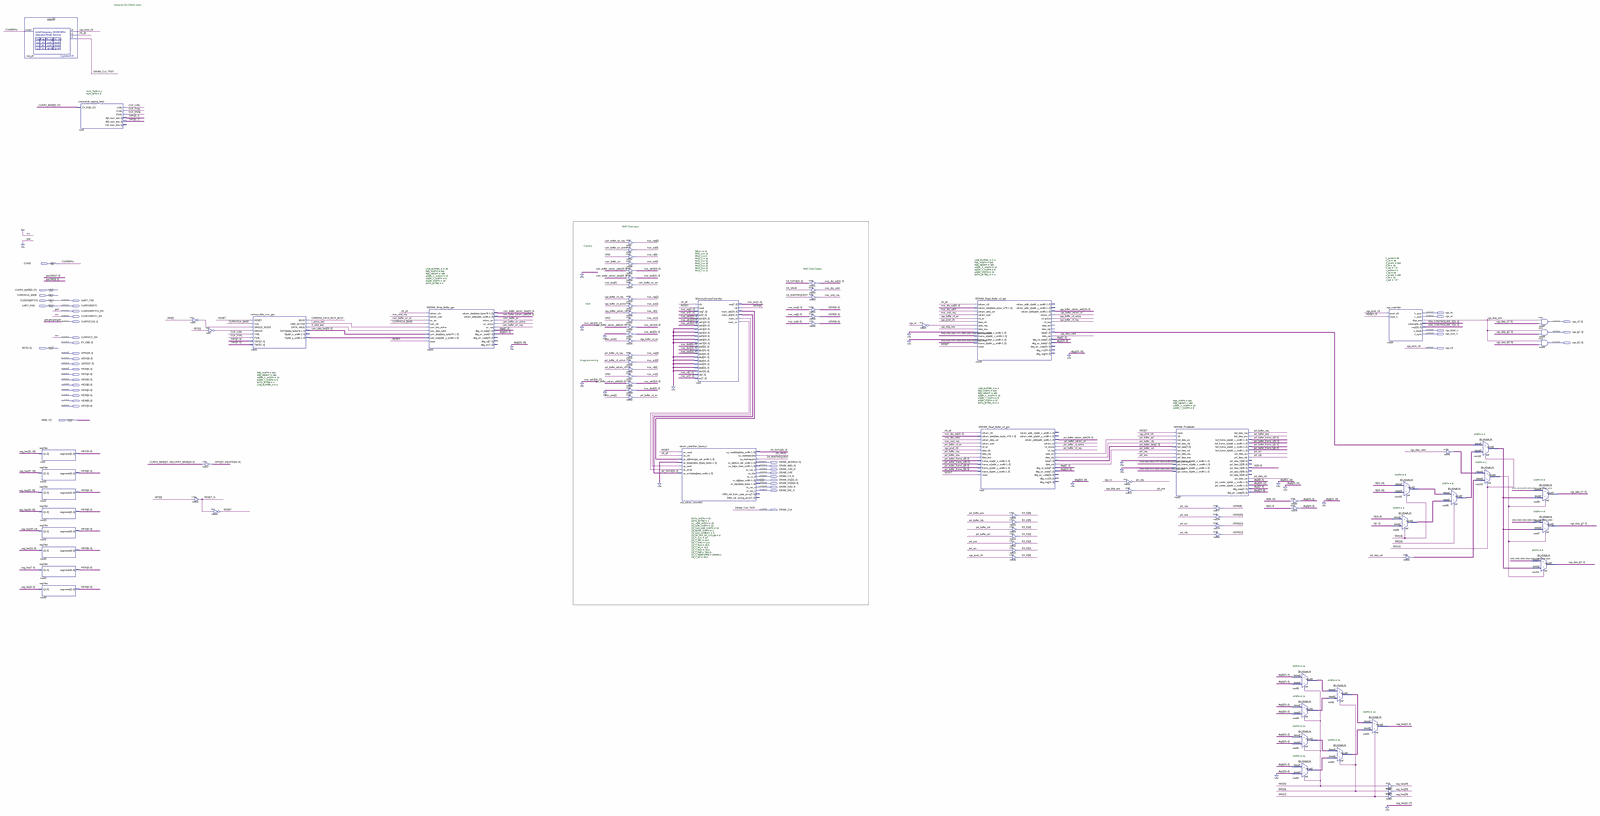
[diagram p0: schematic sheet, whole]
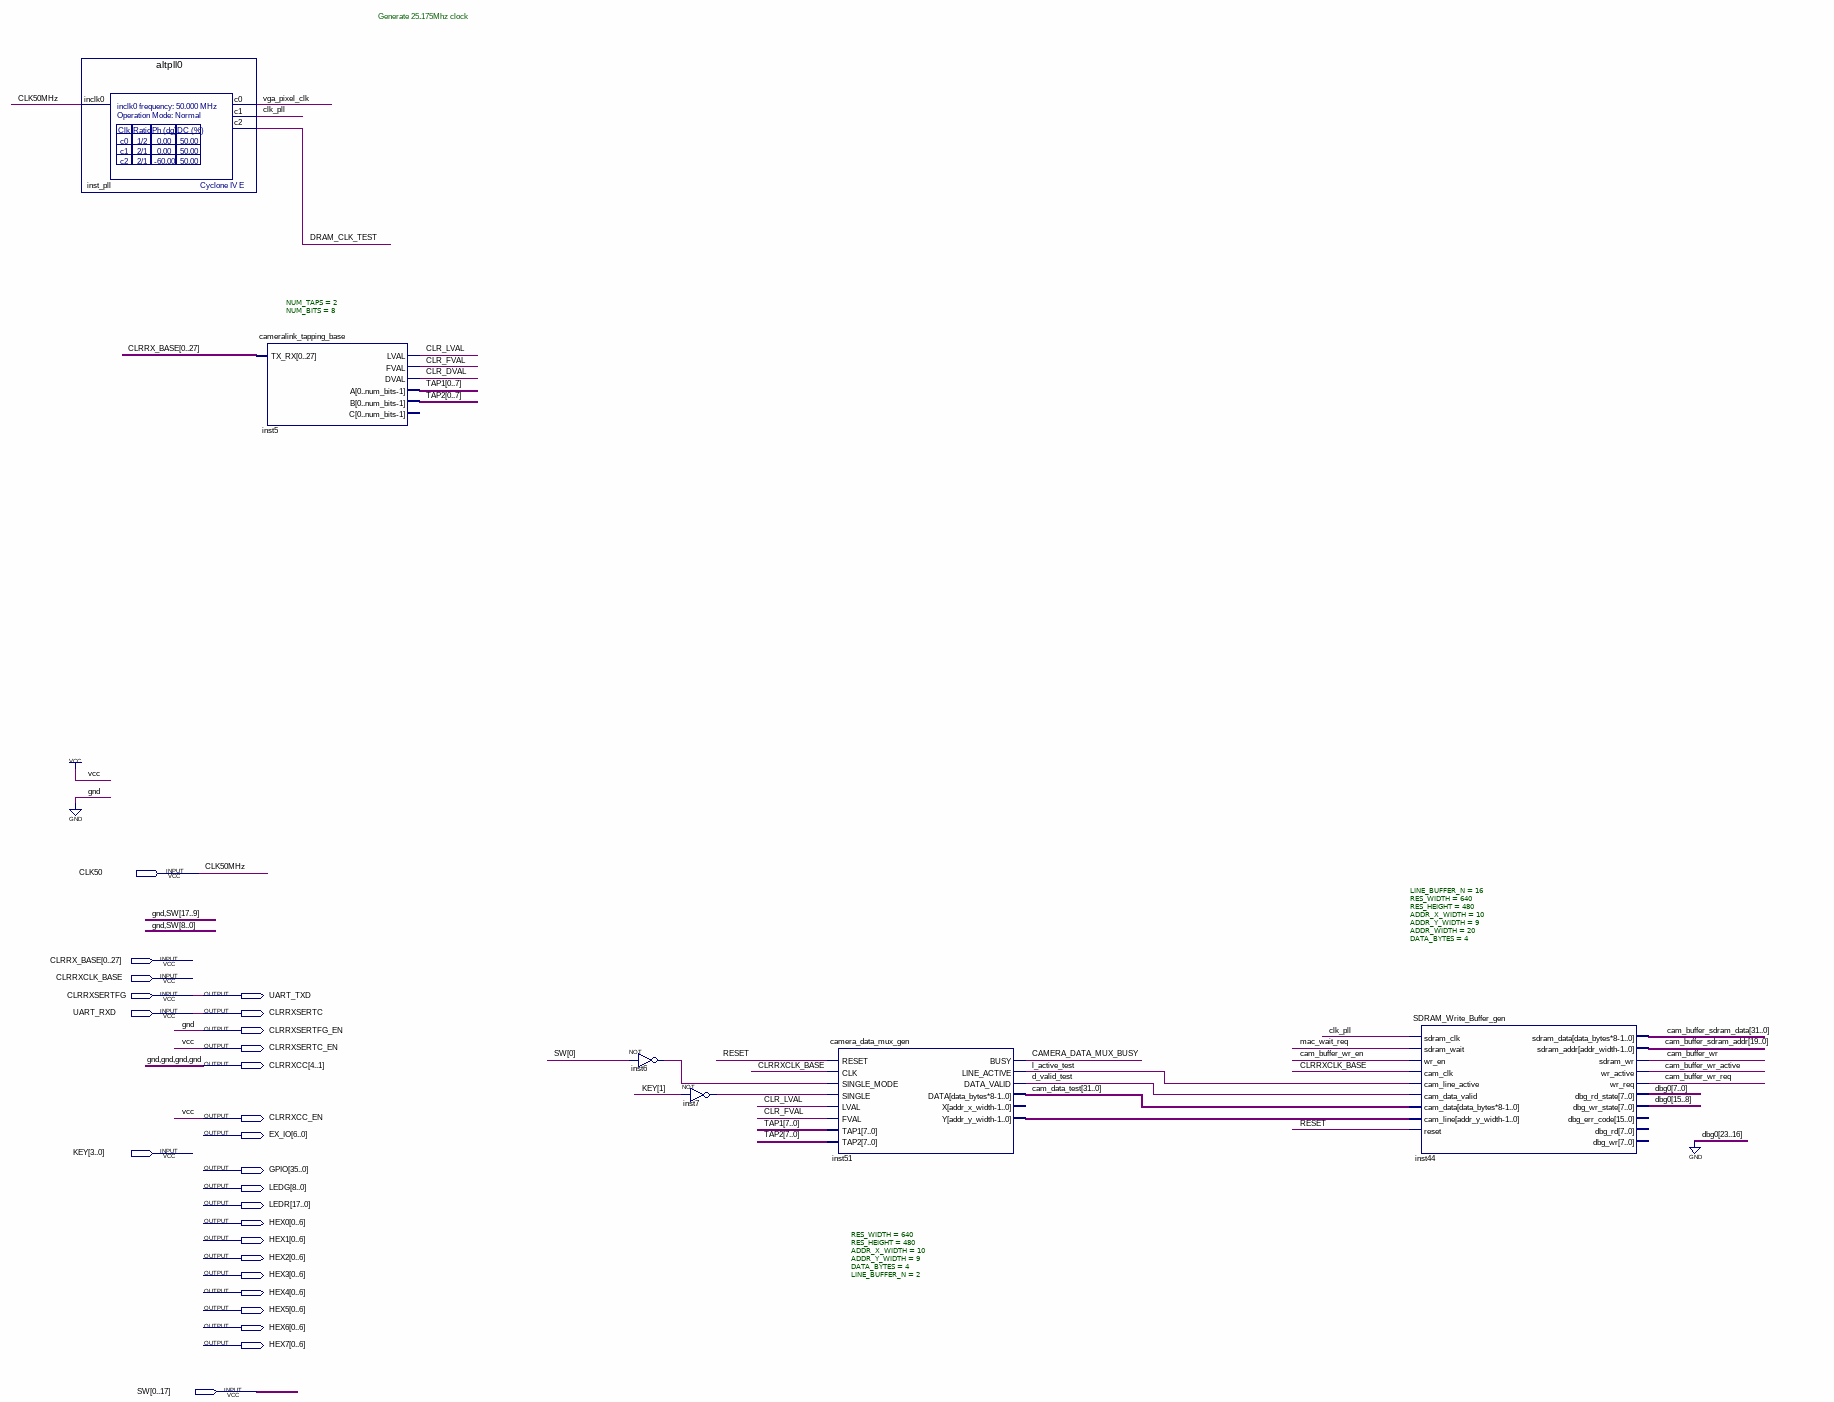
[diagram p1: schematic sheet, upper left part]
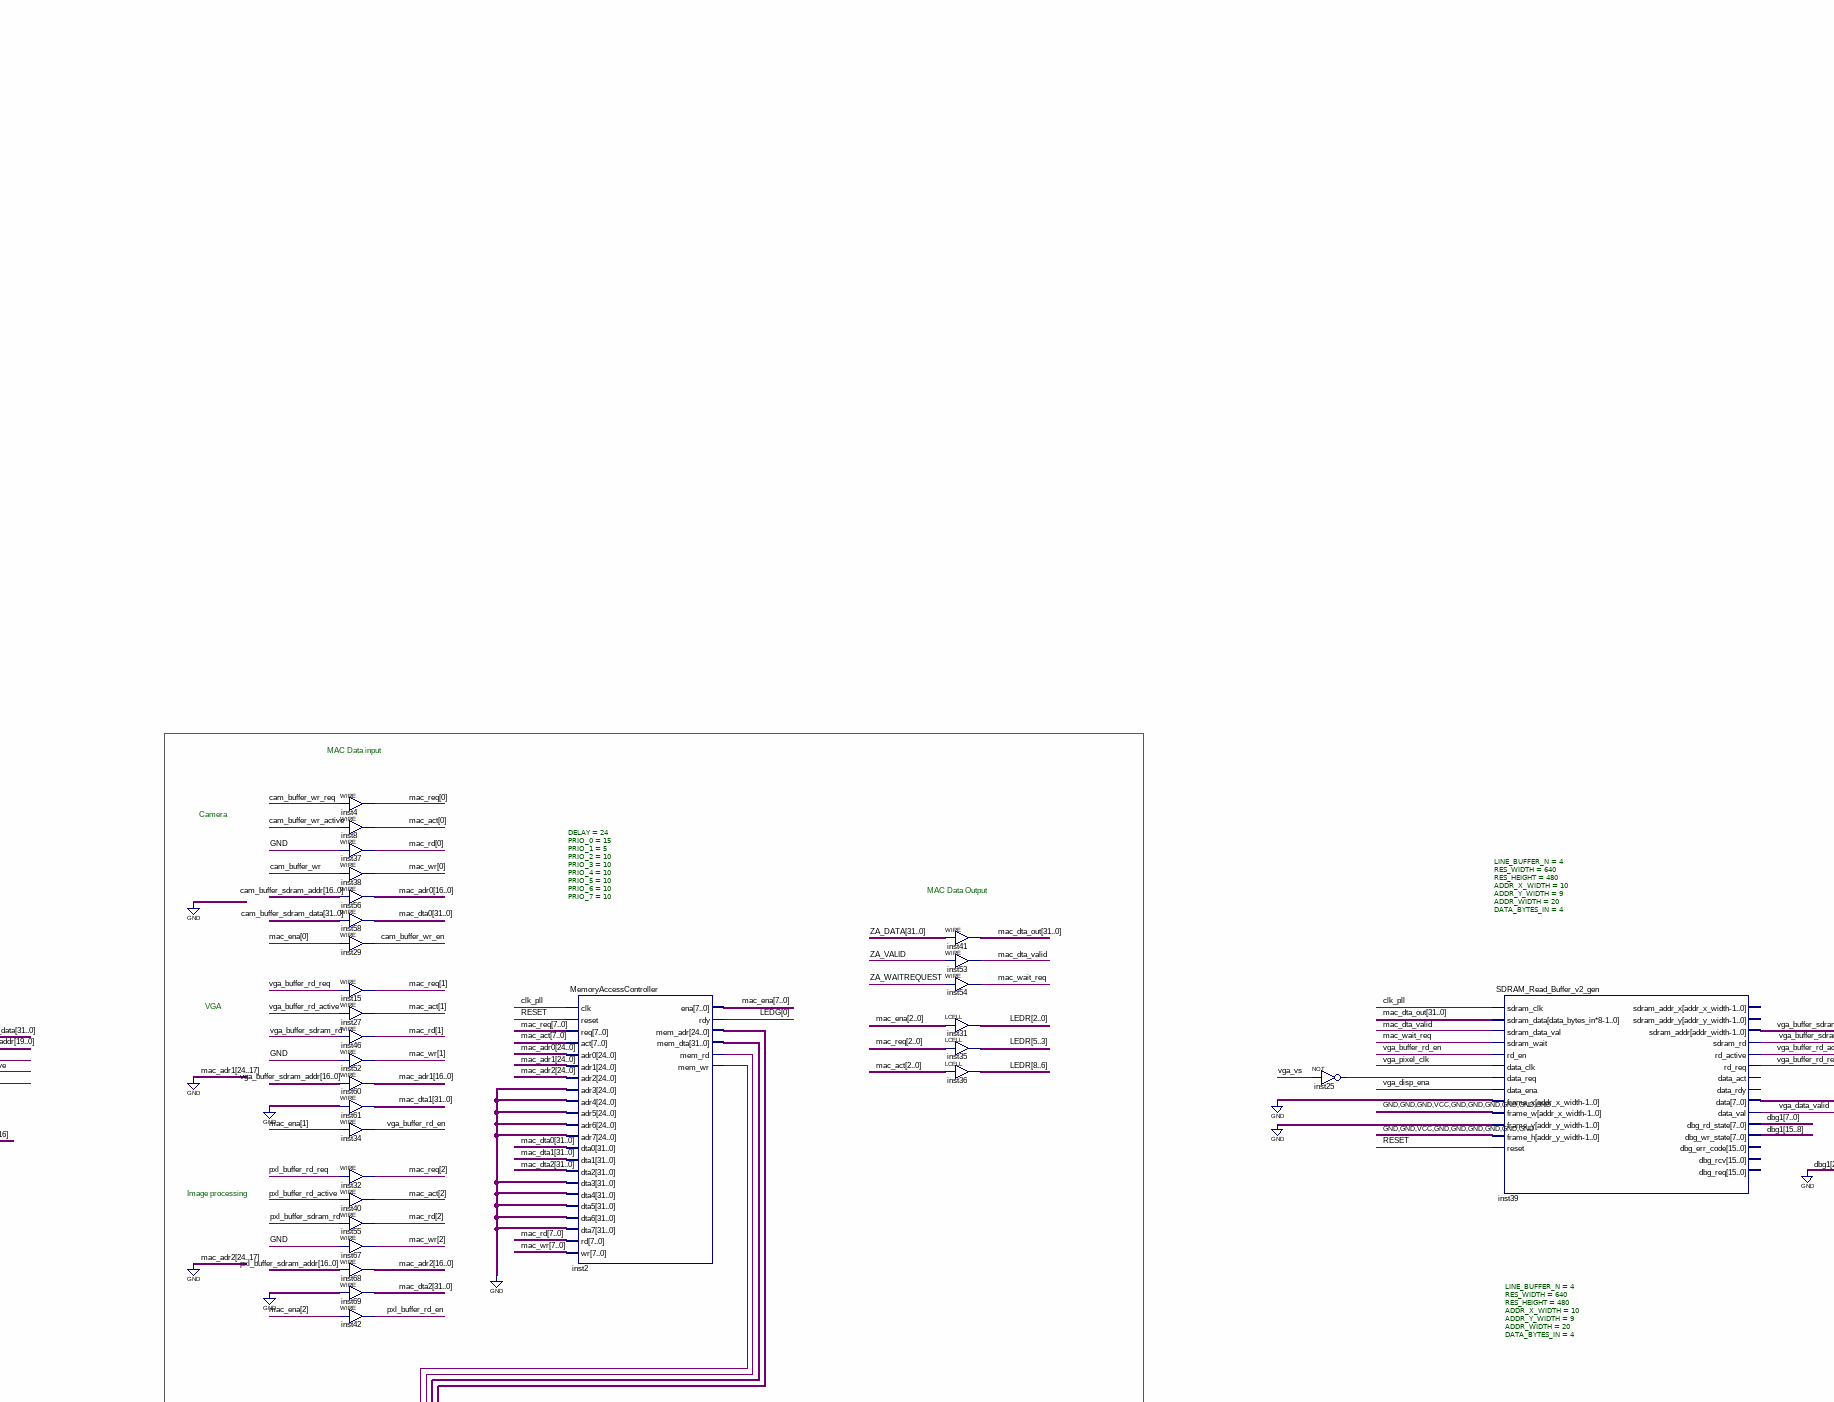
[diagram p2: schematic sheet, upper centre part]
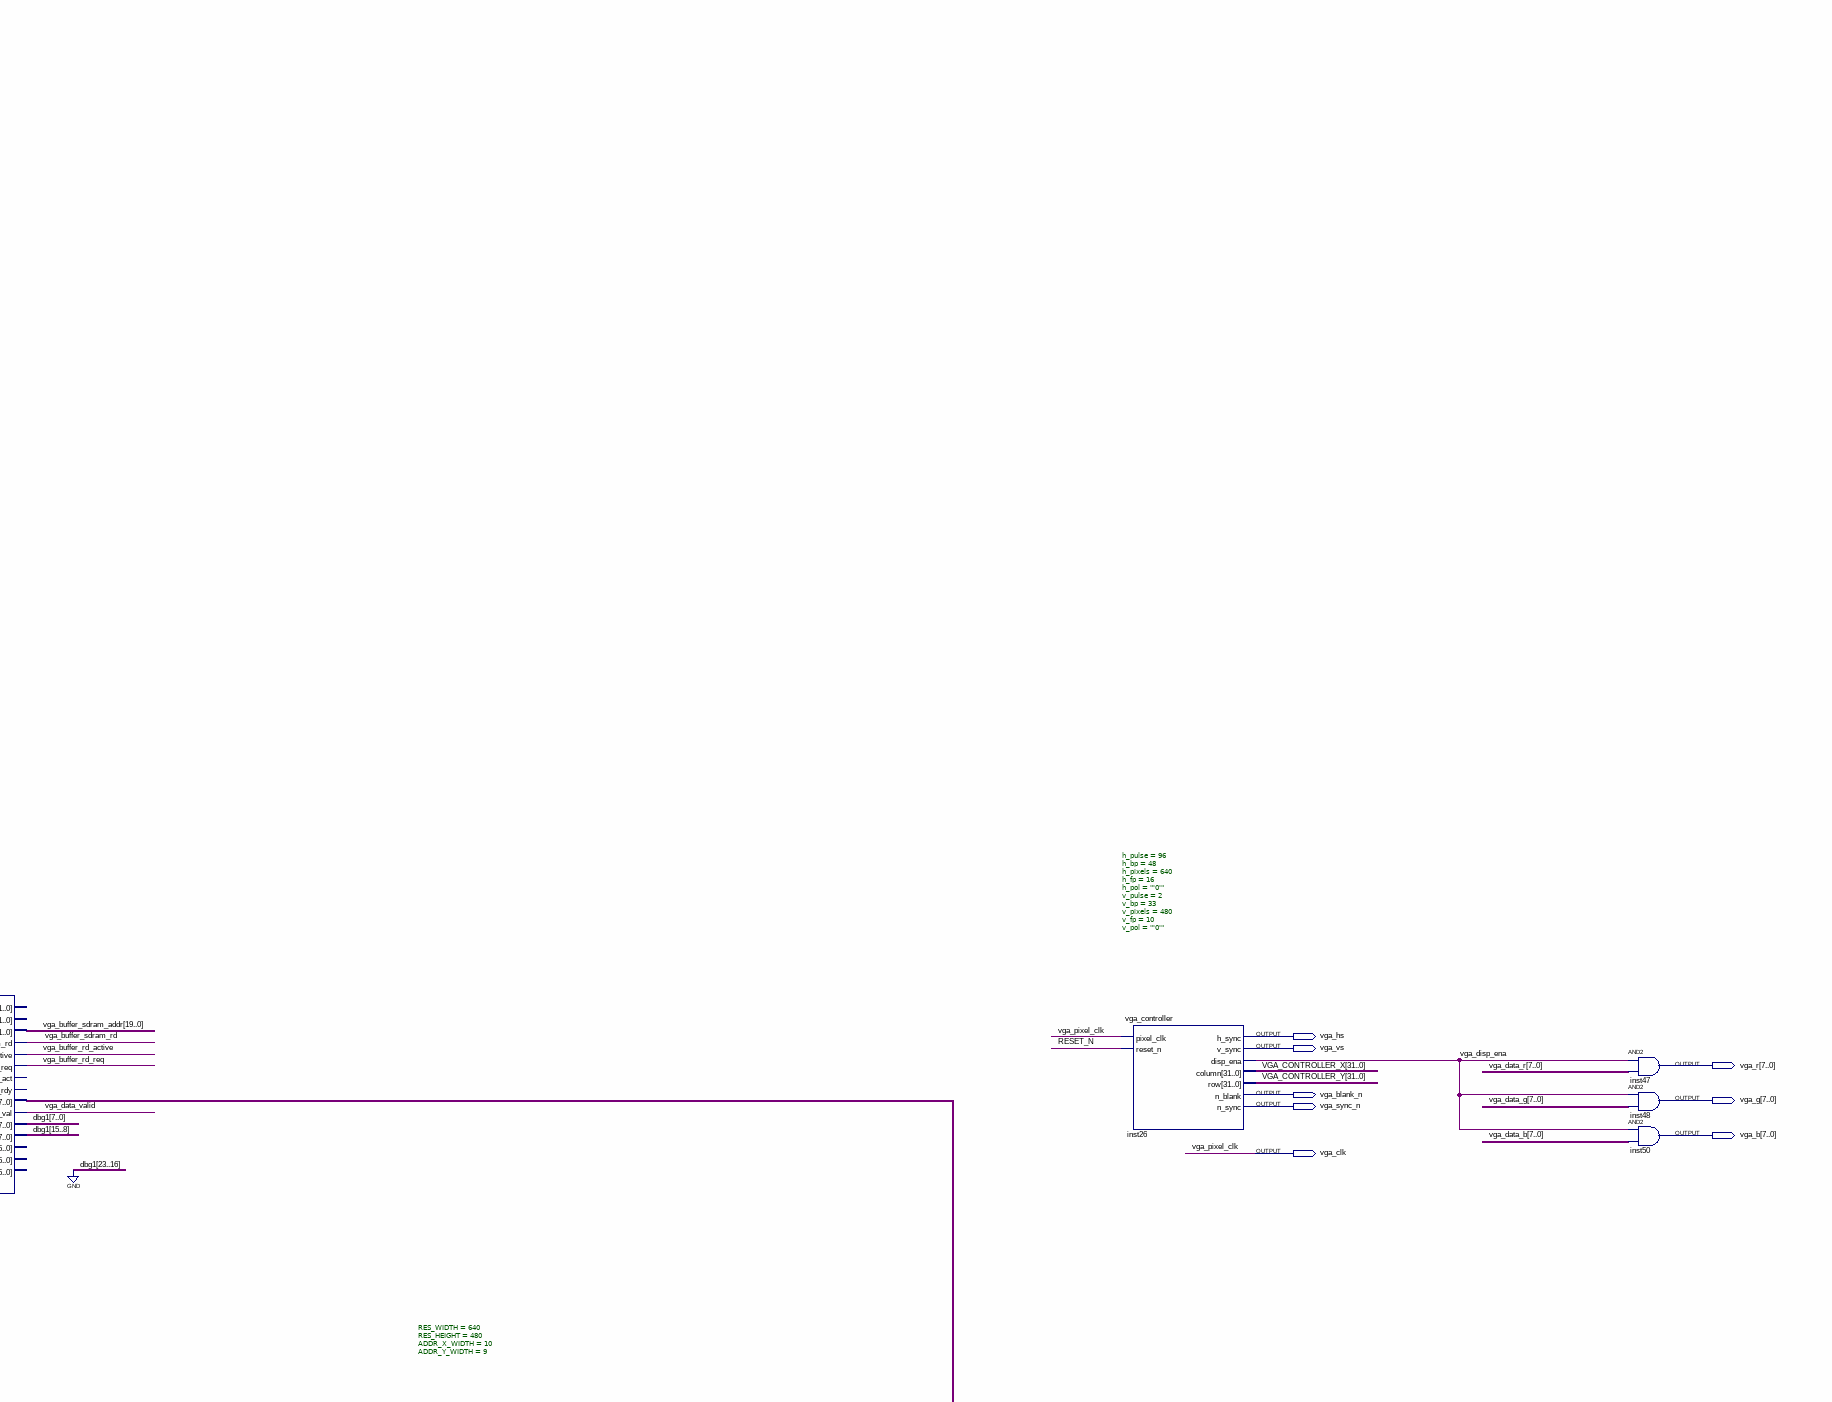
[diagram p3: schematic sheet, upper right part]
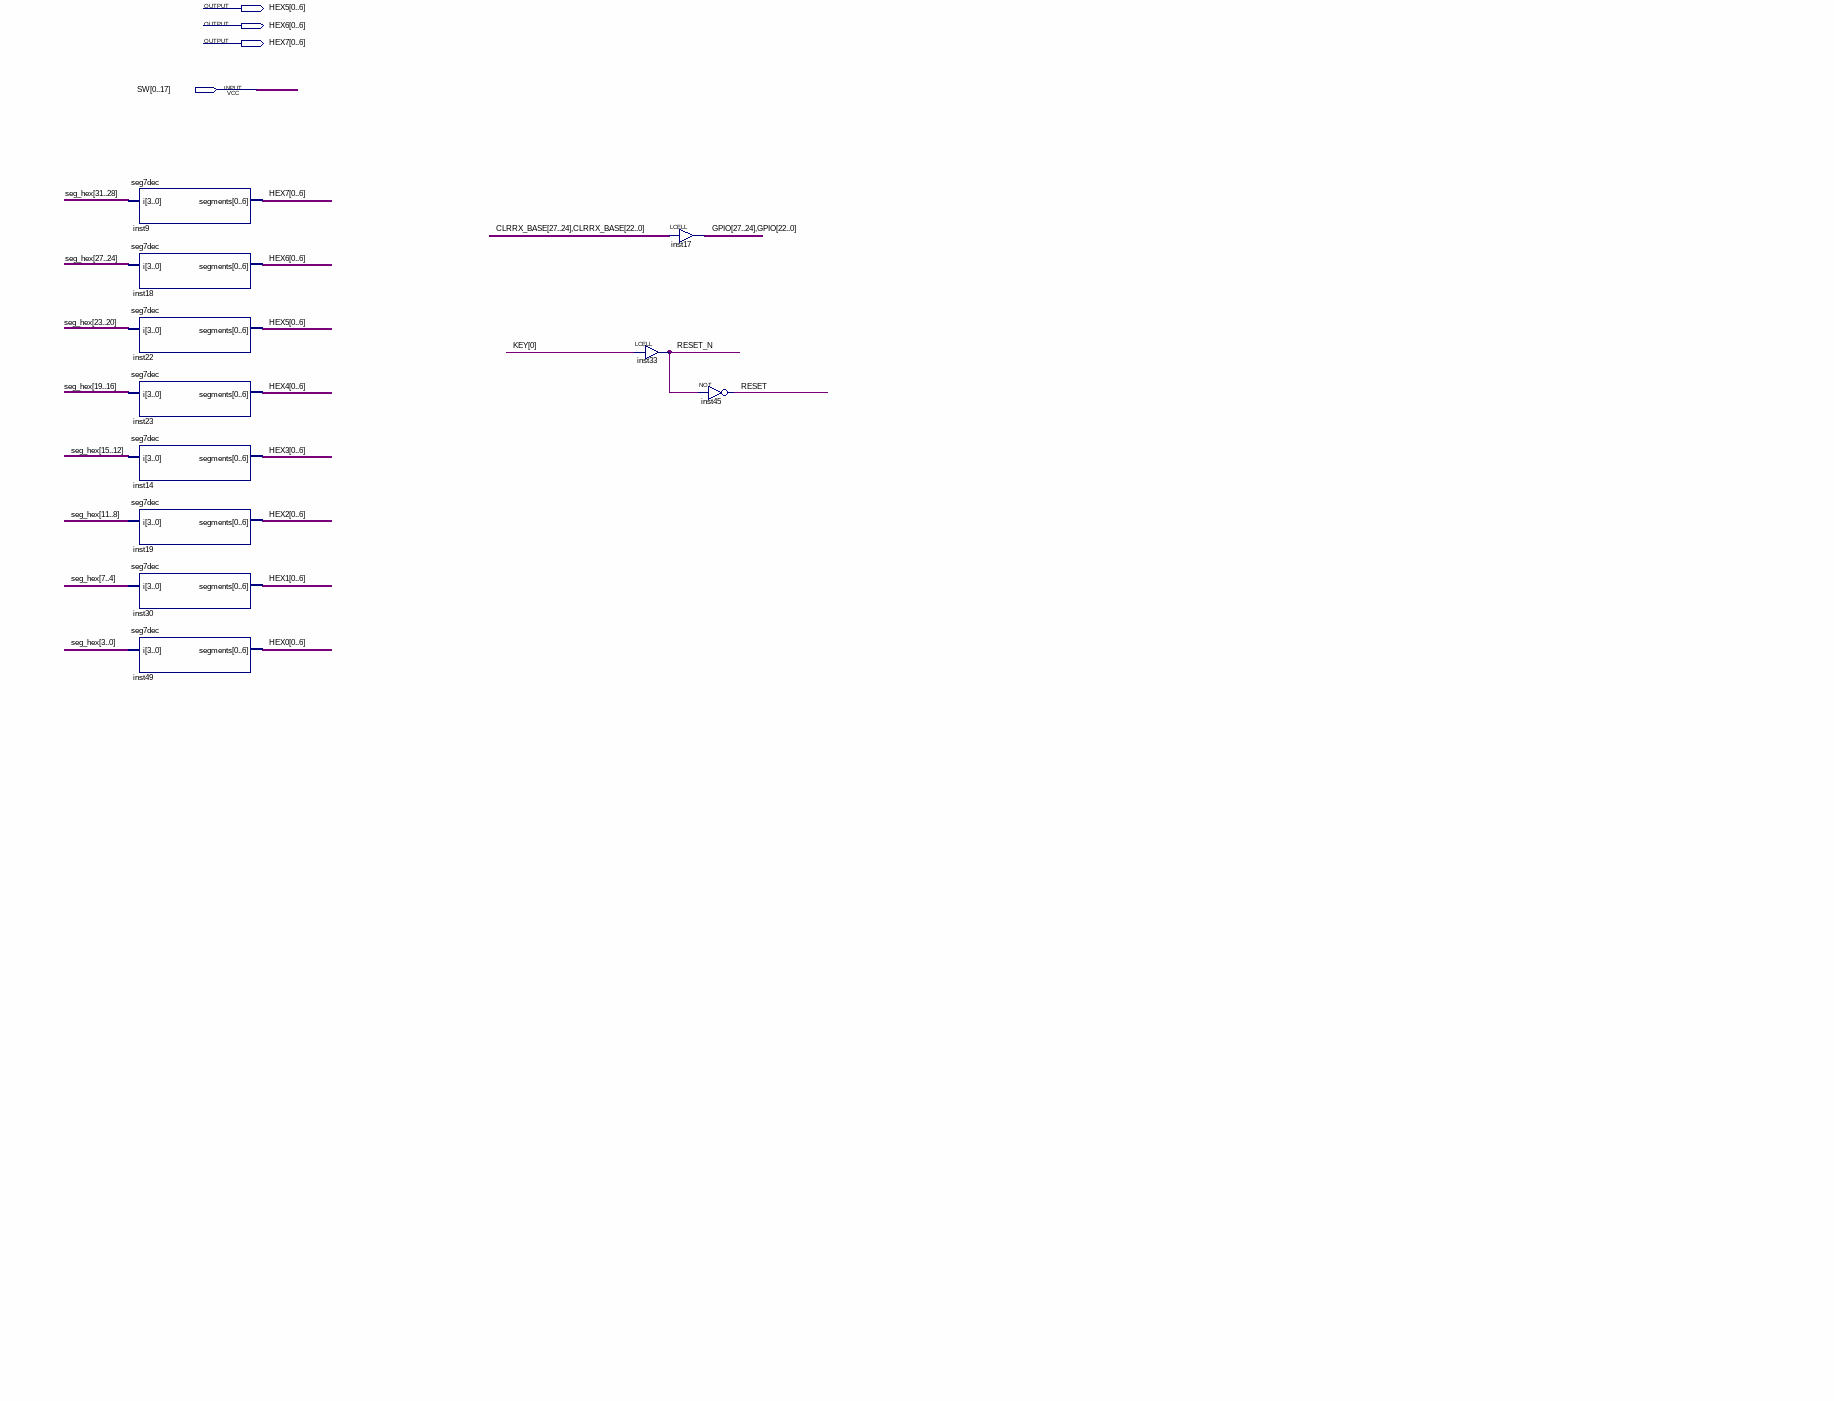
[diagram p4: schematic sheet, lower left part]
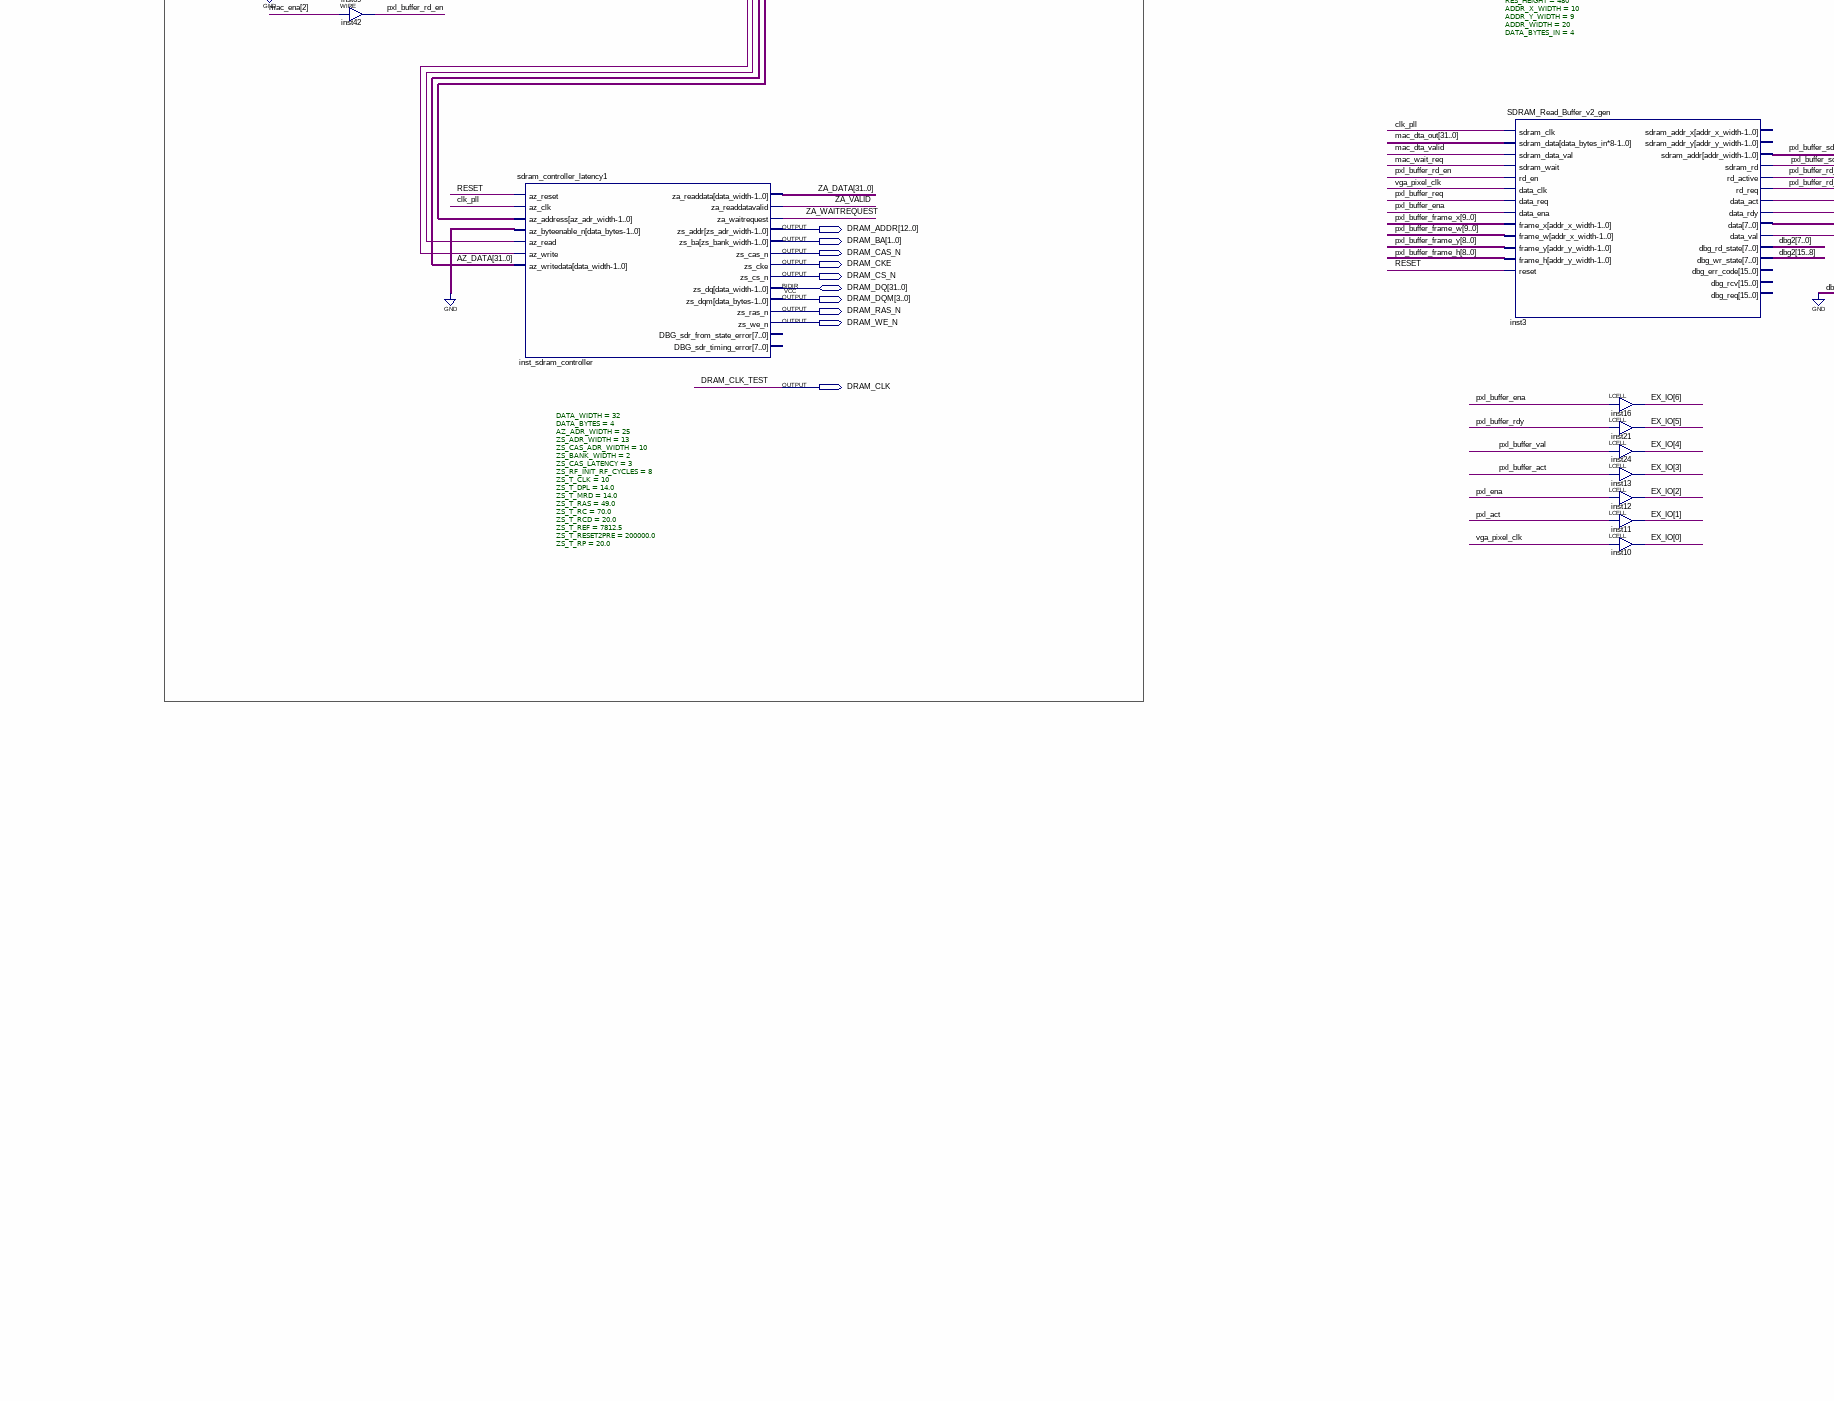
[diagram p5: schematic sheet, lower centre part]
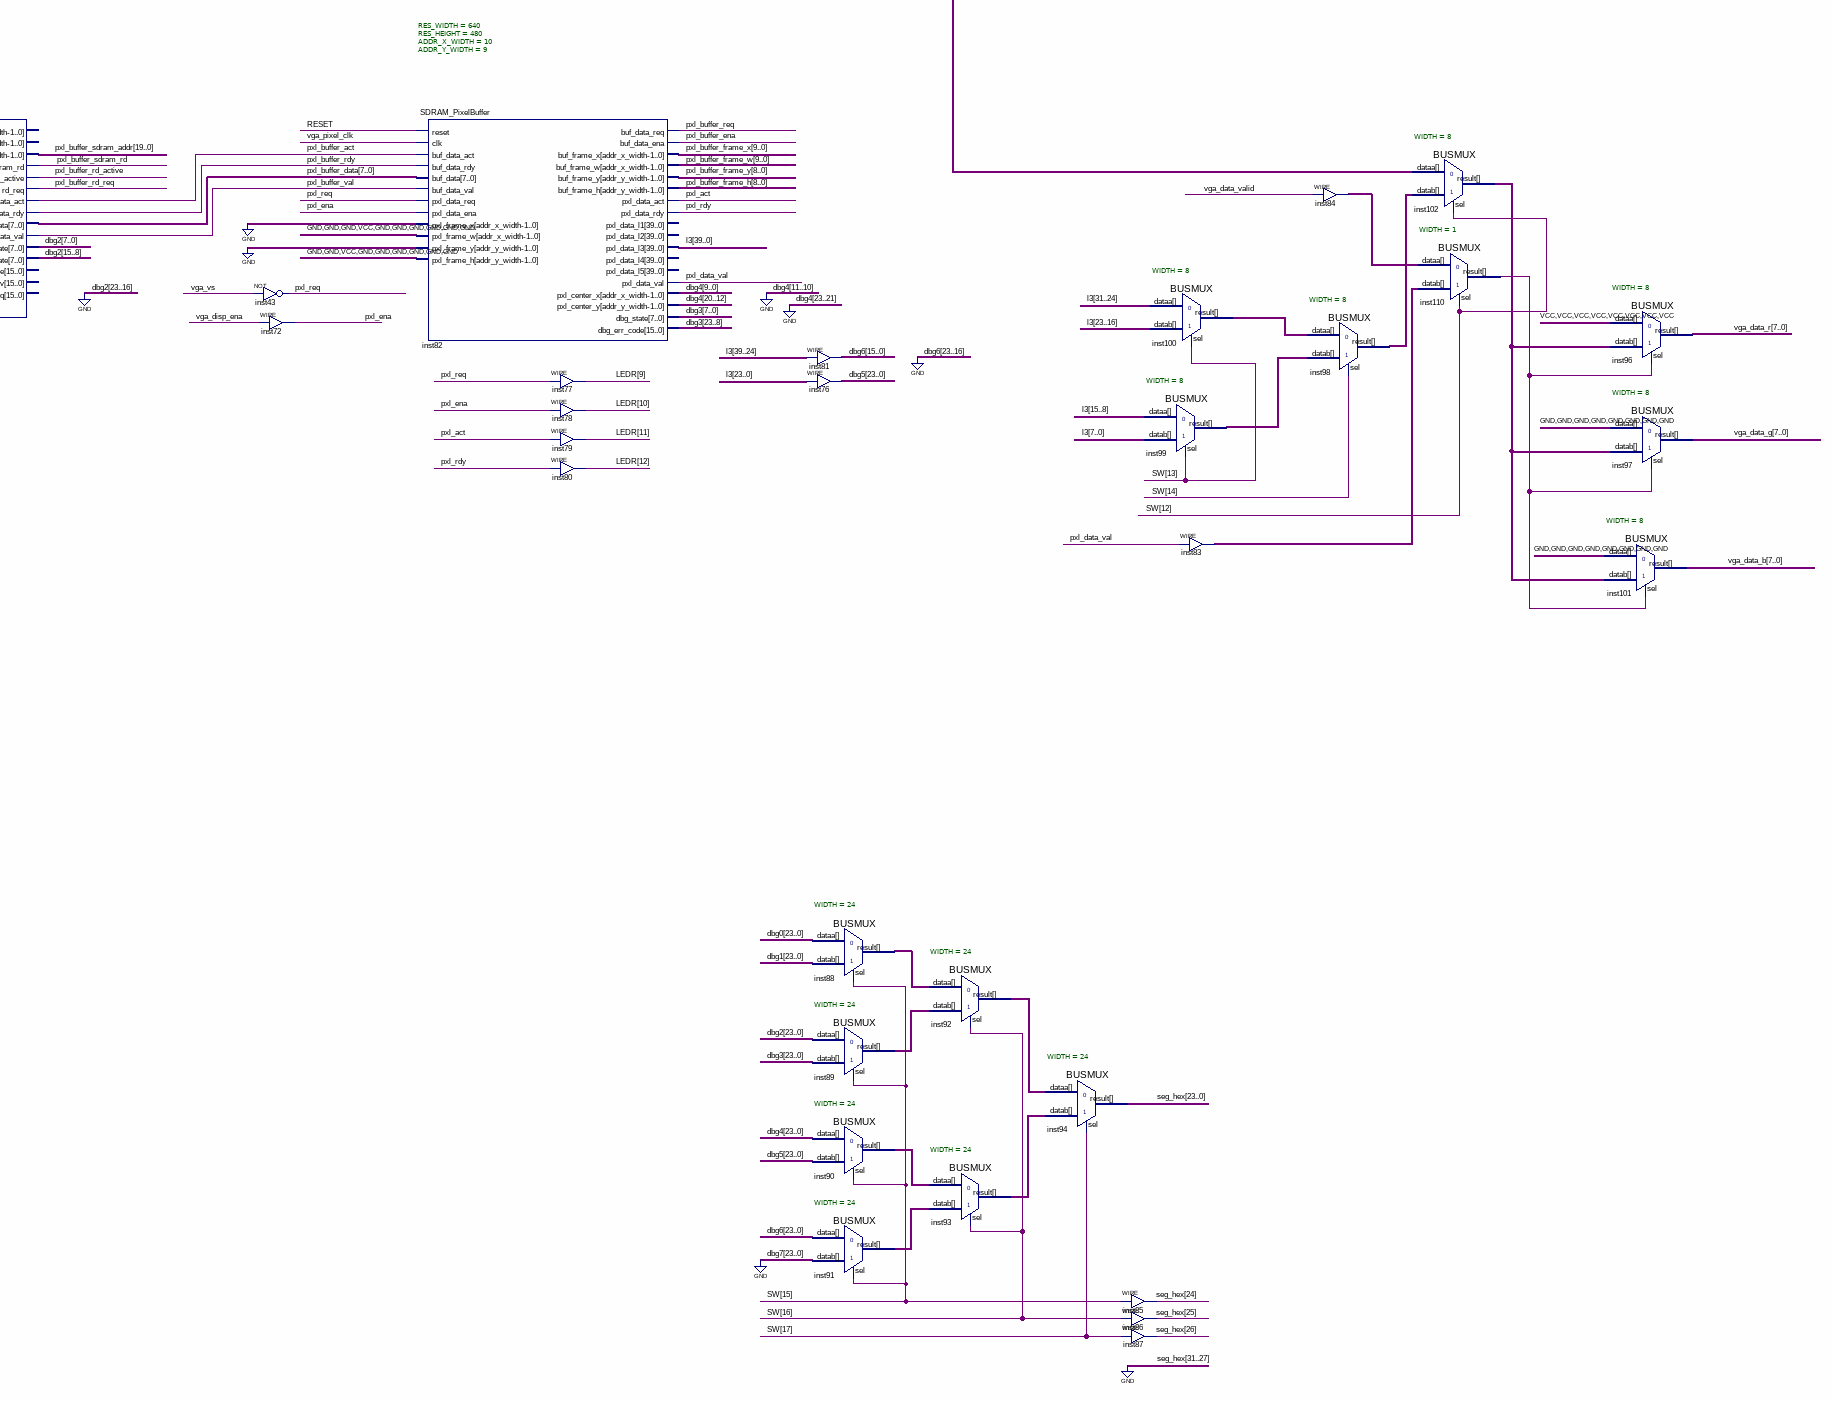
[diagram p6: schematic sheet, lower right part]
// Quartus schematic sdram-pixelbuffer.bdf as structural Verilog: 89 symbols, 43 pins
module \sdram-pixelbuffer  (
  input  CLK50,
  input  [0:27] CLRRX_BASE,
  input  CLRRXCLK_BASE,
  input  CLRRXSERTFG,
  input  UART_RXD,
  input  [3:0] KEY,
  input  [0:17] SW,
  inout  [31:0] DRAM_DQ,
  output UART_TXD,
  output CLRRXSERTC,
  output CLRRXSERTFG_EN,
  output vga_hs,
  output CLRRXSERTC_EN,
  output vga_vs,
  output [4:1] CLRRXCC,
  output [7:0] vga_r,
  output vga_blank_n,
  output [7:0] vga_g,
  output vga_sync_n,
  output CLRRXCC_EN,
  output [6:0] EX_IO,
  output [7:0] vga_b,
  output vga_clk,
  output [35:0] GPIO,
  output [8:0] LEDG,
  output [17:0] LEDR,
  output [0:6] HEX0,
  output [0:6] HEX1,
  output [0:6] HEX2,
  output [0:6] HEX3,
  output [0:6] HEX4,
  output [0:6] HEX5,
  output [0:6] HEX6,
  output [0:6] HEX7,
  output [12:0] DRAM_ADDR,
  output [1:0] DRAM_BA,
  output DRAM_CAS_N,
  output DRAM_CKE,
  output DRAM_CS_N,
  output [3:0] DRAM_DQM,
  output DRAM_RAS_N,
  output DRAM_WE_N,
  output DRAM_CLK
);

  wire cam_buffer_wr, cam_buffer_wr_active, cam_buffer_wr_en, cam_buffer_wr_req, CAMERA_DATA_MUX_BUSY,
       clk_pll, CLR_DVAL, CLR_FVAL, CLR_LVAL, d_valid_test, inst2_mem_rd, inst2_mem_wr, inst6_out, inst7_out,
       inst25_out, inst83_out, inst84_out, inst110_result, l_active_test, mac_dta_valid, mac_wait_req,
       pxl_act, pxl_buffer_act, pxl_buffer_ena, pxl_buffer_rd_active, pxl_buffer_rd_en, pxl_buffer_rd_req,
       pxl_buffer_rdy, pxl_buffer_req, pxl_buffer_sdram_rd, pxl_buffer_val, pxl_data_val, pxl_ena, pxl_rdy,
       pxl_req, RESET, RESET_N, vga_buffer_rd_active, vga_buffer_rd_en, vga_buffer_rd_req,
       vga_buffer_sdram_rd, vga_data_valid, vga_disp_ena, ZA_VALID, ZA_WAITREQUEST;
  wire [7:0] inst39_data, inst98_result, inst99_result, inst100_result, inst102_result, mac_act, mac_ena,
       mac_rd, mac_req, mac_wr, pxl_buffer_data, TAP1, TAP2, vga_data_b, vga_data_g, vga_data_r;
  wire [8:0] inst51_y, pxl_buffer_frame_h, pxl_buffer_frame_y;
  wire [9:0] pxl_buffer_frame_w, pxl_buffer_frame_x;
  wire [15:0] dbg0, dbg1, dbg2, dbg6;
  wire [16:0] mac_adr1, mac_adr2;
  wire [19:0] cam_buffer_sdram_addr, pxl_buffer_sdram_addr, vga_buffer_sdram_addr;
  wire [20:0] dbg4;
  wire [23:0] dbg3, dbg5, inst88_result, inst89_result, inst90_result, inst91_result, inst92_result,
       inst93_result;
  wire [24:0] inst2_mem_adr, mac_adr0;
  wire [26:0] seg_hex;
  wire [31:0] AZ_DATA, cam_buffer_sdram_data, cam_data_test, mac_dta0, mac_dta1, mac_dta2, mac_dta_out,
       VGA_CONTROLLER_X, VGA_CONTROLLER_Y, ZA_DATA;
  wire [39:0] l3;

  altpll0 inst_pll (.inclk0(CLK50), .c0(vga_clk), .c1(clk_pll), .c2(DRAM_CLK));
  seg7dec inst9 (.i(4'b0000), .segments(HEX7));
  seg7dec inst18 (.i({1'b0, seg_hex[26:24]}), .segments(HEX6));
  seg7dec inst22 (.i(seg_hex[23:20]), .segments(HEX5));
  seg7dec inst23 (.i(seg_hex[19:16]), .segments(HEX4));
  seg7dec inst14 (.i(seg_hex[15:12]), .segments(HEX3));
  seg7dec inst19 (.i(seg_hex[11:8]), .segments(HEX2));
  seg7dec inst30 (.i(seg_hex[7:4]), .segments(HEX1));
  seg7dec inst49 (.i(seg_hex[3:0]), .segments(HEX0));
  cameralink_tapping_base #(.NUM_TAPS(2), .NUM_BITS(8)) inst5 (
    .TX_RX(CLRRX_BASE), .LVAL(CLR_LVAL), .FVAL(CLR_FVAL), .DVAL(CLR_DVAL),
    .A({TAP1[0], TAP1[1], TAP1[2], TAP1[3], TAP1[4], TAP1[5], TAP1[6], TAP1[7]}),
    .B({TAP2[0], TAP2[1], TAP2[2], TAP2[3], TAP2[4], TAP2[5], TAP2[6], TAP2[7]}));  // open: C
  not inst6 (inst6_out, SW[0]);
  LCELL inst33 (.IN(KEY[0]), .OUT(RESET_N));
  not inst7 (inst7_out, KEY[1]);
  LCELL inst17[26:0] (
    .IN({CLRRX_BASE[27], CLRRX_BASE[26], CLRRX_BASE[25], CLRRX_BASE[24], CLRRX_BASE[22], CLRRX_BASE[21], CLRRX_BASE[20], CLRRX_BASE[19], CLRRX_BASE[18], CLRRX_BASE[17], CLRRX_BASE[16], CLRRX_BASE[15], CLRRX_BASE[14], CLRRX_BASE[13], CLRRX_BASE[12], CLRRX_BASE[11], CLRRX_BASE[10], CLRRX_BASE[9], CLRRX_BASE[8], CLRRX_BASE[7], CLRRX_BASE[6], CLRRX_BASE[5], CLRRX_BASE[4], CLRRX_BASE[3], CLRRX_BASE[2], CLRRX_BASE[1], CLRRX_BASE[0]}),
    .OUT({GPIO[27:24], GPIO[22:0]}));
  not inst45 (RESET, RESET_N);
  camera_data_mux_gen #(.RES_WIDTH(640), .RES_HEIGHT(480), .ADDR_X_WIDTH(10), .ADDR_Y_WIDTH(9), .DATA_BYTES(4), .LINE_BUFFER_N(2)) inst51 (
    .RESET(RESET), .CLK(CLRRXCLK_BASE), .SINGLE_MODE(inst6_out), .SINGLE(inst7_out), .LVAL(CLR_LVAL),
    .FVAL(CLR_FVAL), .TAP1(TAP1), .TAP2(TAP2), .BUSY(CAMERA_DATA_MUX_BUSY), .LINE_ACTIVE(l_active_test),
    .DATA_VALID(d_valid_test), .DATA(cam_data_test), .Y(inst51_y));  // open: X
  SDRAM_Write_Buffer_gen #(.LINE_BUFFER_N(16), .RES_WIDTH(640), .RES_HEIGHT(480), .ADDR_X_WIDTH(10), .ADDR_Y_WIDTH(9), .ADDR_WIDTH(20), .DATA_BYTES(4)) inst44 (
    .sdram_clk(clk_pll), .sdram_wait(mac_wait_req), .wr_en(cam_buffer_wr_en), .cam_clk(CLRRXCLK_BASE),
    .cam_line_active(l_active_test), .cam_data_valid(d_valid_test), .cam_data(cam_data_test),
    .cam_line(inst51_y), .reset(RESET), .sdram_data(cam_buffer_sdram_data),
    .sdram_addr(cam_buffer_sdram_addr), .sdram_wr(cam_buffer_wr), .wr_active(cam_buffer_wr_active),
    .wr_req(cam_buffer_wr_req), .dbg_rd_state(dbg0[7:0]), .dbg_wr_state(dbg0[15:8]));  // open: dbg_err_code, dbg_rd, dbg_wr
  assign mac_req[0] = cam_buffer_wr_req;  // WIRE inst4
  assign mac_act[0] = cam_buffer_wr_active;  // WIRE inst8
  assign mac_rd[0] = 1'b0;  // WIRE inst37
  assign mac_wr[0] = cam_buffer_wr;  // WIRE inst38
  assign mac_adr0[16:0] = cam_buffer_sdram_addr[16:0];  // WIRE inst56
  assign mac_dta0 = cam_buffer_sdram_data;  // WIRE inst58
  assign cam_buffer_wr_en = mac_ena[0];  // WIRE inst29
  assign mac_req[1] = vga_buffer_rd_req;  // WIRE inst15
  assign mac_act[1] = vga_buffer_rd_active;  // WIRE inst27
  assign mac_rd[1] = vga_buffer_sdram_rd;  // WIRE inst46
  assign mac_wr[1] = 1'b0;  // WIRE inst52
  assign mac_adr1 = vga_buffer_sdram_addr[16:0];  // WIRE inst60
  assign mac_dta1 = {32{1'b0}};  // WIRE inst61
  assign vga_buffer_rd_en = mac_ena[1];  // WIRE inst34
  assign mac_req[2] = pxl_buffer_rd_req;  // WIRE inst32
  assign mac_act[2] = pxl_buffer_rd_active;  // WIRE inst40
  assign mac_rd[2] = pxl_buffer_sdram_rd;  // WIRE inst55
  assign mac_wr[2] = 1'b0;  // WIRE inst67
  assign mac_adr2 = pxl_buffer_sdram_addr[16:0];  // WIRE inst68
  assign mac_dta2 = {32{1'b0}};  // WIRE inst69
  assign pxl_buffer_rd_en = mac_ena[2];  // WIRE inst42
  sdram_controller_latency1 #(.DATA_WIDTH(32), .DATA_BYTES(4), .AZ_ADR_WIDTH(25), .ZS_ADR_WIDTH(13), .ZS_CAS_ADR_WIDTH(10), .ZS_BANK_WIDTH(2), .ZS_CAS_LATENCY(3), .ZS_RF_INIT_RF_CYCLES(8), .ZS_T_CLK(10), .ZS_T_DPL(14.0), .ZS_T_MRD(14.0), .ZS_T_RAS(49.0), .ZS_T_RC(70.0), .ZS_T_RCD(20.0), .ZS_T_REF(7812.5), .ZS_T_RESET2PRE(200000.0), .ZS_T_RP(20.0)) inst_sdram_controller (
    .az_reset(RESET), .az_clk(clk_pll), .az_address(inst2_mem_adr), .az_byteenable_n(4'b0000),
    .az_read(inst2_mem_rd), .az_write(inst2_mem_wr), .az_writedata(AZ_DATA), .za_readdata(ZA_DATA),
    .za_readdatavalid(ZA_VALID), .za_waitrequest(ZA_WAITREQUEST), .zs_addr(DRAM_ADDR), .zs_ba(DRAM_BA),
    .zs_cas_n(DRAM_CAS_N), .zs_cke(DRAM_CKE), .zs_cs_n(DRAM_CS_N), .zs_dqm(DRAM_DQM), .zs_ras_n(DRAM_RAS_N),
    .zs_we_n(DRAM_WE_N), .zs_dq(DRAM_DQ));  // open: DBG_sdr_from_state_error, DBG_sdr_timing_error
  MemoryAccessController #(.DELAY(24), .PRIO_0(15), .PRIO_1(5), .PRIO_2(10), .PRIO_3(10), .PRIO_4(10), .PRIO_5(10), .PRIO_6(10), .PRIO_7(10)) inst2 (
    .clk(clk_pll), .reset(RESET), .req(mac_req), .act(mac_act), .adr0(mac_adr0),
    .adr1({{8{1'b0}}, mac_adr1}), .adr2({{8{1'b0}}, mac_adr2}), .adr3({32{1'b0}}), .adr4({32{1'b0}}),
    .adr5({32{1'b0}}), .adr6({32{1'b0}}), .adr7({32{1'b0}}), .dta0(mac_dta0), .dta1(mac_dta1),
    .dta2(mac_dta2), .dta3({32{1'b0}}), .dta4({32{1'b0}}), .dta5({32{1'b0}}), .dta6({32{1'b0}}),
    .dta7({32{1'b0}}), .rd(mac_rd), .wr(mac_wr), .ena(mac_ena), .rdy(LEDG[0]), .mem_adr(inst2_mem_adr),
    .mem_dta(AZ_DATA), .mem_rd(inst2_mem_rd), .mem_wr(inst2_mem_wr));
  assign mac_dta_out = ZA_DATA;  // WIRE inst41
  assign mac_dta_valid = ZA_VALID;  // WIRE inst53
  assign mac_wait_req = ZA_WAITREQUEST;  // WIRE inst54
  LCELL inst31[2:0] (.IN(mac_ena[2:0]), .OUT(LEDR[2:0]));
  LCELL inst35[2:0] (.IN(mac_req[2:0]), .OUT(LEDR[5:3]));
  LCELL inst36[2:0] (.IN(mac_act[2:0]), .OUT(LEDR[8:6]));
  not inst25 (inst25_out, vga_vs);
  SDRAM_Read_Buffer_v2_gen #(.LINE_BUFFER_N(4), .RES_WIDTH(640), .RES_HEIGHT(480), .ADDR_X_WIDTH(10), .ADDR_Y_WIDTH(9), .ADDR_WIDTH(20), .DATA_BYTES_IN(4)) inst39 (
    .sdram_clk(clk_pll), .sdram_data(mac_dta_out), .sdram_data_val(mac_dta_valid), .sdram_wait(mac_wait_req),
    .rd_en(vga_buffer_rd_en), .data_clk(vga_clk), .data_req(inst25_out), .data_ena(vga_disp_ena),
    .frame_x({10{1'b0}}), .frame_w(10'b0001000000), .frame_y({9{1'b0}}), .frame_h(9'b001000000),
    .reset(RESET), .sdram_addr(vga_buffer_sdram_addr), .sdram_rd(vga_buffer_sdram_rd),
    .rd_active(vga_buffer_rd_active), .rd_req(vga_buffer_rd_req), .data(inst39_data),
    .data_val(vga_data_valid), .dbg_rd_state(dbg1[7:0]), .dbg_wr_state(dbg1[15:8]));  // open: sdram_addr_x, sdram_addr_y, data_act, data_rdy, dbg_err_code, dbg_rcv, dbg_req
  SDRAM_Read_Buffer_v2_gen #(.LINE_BUFFER_N(4), .RES_WIDTH(640), .RES_HEIGHT(480), .ADDR_X_WIDTH(10), .ADDR_Y_WIDTH(9), .ADDR_WIDTH(20), .DATA_BYTES_IN(4)) inst3 (
    .sdram_clk(clk_pll), .sdram_data(mac_dta_out), .sdram_data_val(mac_dta_valid), .sdram_wait(mac_wait_req),
    .rd_en(pxl_buffer_rd_en), .data_clk(vga_clk), .data_req(pxl_buffer_req), .data_ena(pxl_buffer_ena),
    .frame_x(pxl_buffer_frame_x), .frame_w(pxl_buffer_frame_w), .frame_y(pxl_buffer_frame_y),
    .frame_h(pxl_buffer_frame_h), .reset(RESET), .sdram_addr(pxl_buffer_sdram_addr),
    .sdram_rd(pxl_buffer_sdram_rd), .rd_active(pxl_buffer_rd_active), .rd_req(pxl_buffer_rd_req),
    .data_act(pxl_buffer_act), .data_rdy(pxl_buffer_rdy), .data(pxl_buffer_data), .data_val(pxl_buffer_val),
    .dbg_rd_state(dbg2[7:0]), .dbg_wr_state(dbg2[15:8]));  // open: sdram_addr_x, sdram_addr_y, dbg_err_code, dbg_rcv, dbg_req
  LCELL inst16 (.IN(pxl_buffer_ena), .OUT(EX_IO[6]));
  LCELL inst21 (.IN(pxl_buffer_rdy), .OUT(EX_IO[5]));
  LCELL inst24 (.IN(pxl_buffer_val), .OUT(EX_IO[4]));
  LCELL inst13 (.IN(pxl_buffer_act), .OUT(EX_IO[3]));
  LCELL inst12 (.IN(pxl_ena), .OUT(EX_IO[2]));
  LCELL inst11 (.IN(pxl_act), .OUT(EX_IO[1]));
  LCELL inst10 (.IN(vga_clk), .OUT(EX_IO[0]));
  not inst43 (pxl_req, vga_vs);
  assign pxl_ena = vga_disp_ena;  // WIRE inst72
  SDRAM_PixelBuffer #(.RES_WIDTH(640), .RES_HEIGHT(480), .ADDR_X_WIDTH(10), .ADDR_Y_WIDTH(9)) inst82 (
    .reset(RESET), .clk(vga_clk), .buf_data_act(pxl_buffer_act), .buf_data_rdy(pxl_buffer_rdy),
    .buf_data(pxl_buffer_data), .buf_data_val(pxl_buffer_val), .pxl_data_req(pxl_req),
    .pxl_data_ena(pxl_ena), .pxl_frame_x({10{1'b0}}), .pxl_frame_w(10'b0001000000), .pxl_frame_y({9{1'b0}}),
    .pxl_frame_h(9'b001000000), .buf_data_req(pxl_buffer_req), .buf_data_ena(pxl_buffer_ena),
    .buf_frame_x(pxl_buffer_frame_x), .buf_frame_w(pxl_buffer_frame_w), .buf_frame_y(pxl_buffer_frame_y),
    .buf_frame_h(pxl_buffer_frame_h), .pxl_data_act(pxl_act), .pxl_data_rdy(pxl_rdy), .pxl_data_l3(l3),
    .pxl_data_val(pxl_data_val), .pxl_center_x(dbg4[9:0]), .pxl_center_y(dbg4[20:12]), .dbg_state(dbg3[7:0]),
    .dbg_err_code(dbg3[23:8]));  // open: pxl_data_l1, pxl_data_l2, pxl_data_l4, pxl_data_l5
  assign LEDR[9] = pxl_req;  // WIRE inst77
  assign LEDR[10] = pxl_ena;  // WIRE inst78
  assign LEDR[11] = pxl_act;  // WIRE inst79
  assign LEDR[12] = pxl_rdy;  // WIRE inst80
  assign dbg6 = l3[39:24];  // WIRE inst81
  assign dbg5 = l3[23:0];  // WIRE inst76
  BUSMUX #(.WIDTH(24)) inst88 (
    .datab({{8{1'b0}}, dbg1}), .sel(SW[15]), .dataa({{8{1'b0}}, dbg0}), .result(inst88_result));
  BUSMUX #(.WIDTH(24)) inst89 (.datab(dbg3), .sel(SW[15]), .dataa({{8{1'b0}}, dbg2}), .result(inst89_result));
  BUSMUX #(.WIDTH(24)) inst90 (
    .datab(dbg5), .sel(SW[15]), .dataa({3'b000, dbg4[20:12], 2'b00, dbg4[9:0]}), .result(inst90_result));
  BUSMUX #(.WIDTH(24)) inst91 (.datab({24{1'b0}}), .sel(SW[15]), .dataa({{8{1'b0}}, dbg6}), .result(inst91_result));
  BUSMUX #(.WIDTH(24)) inst92 (.datab(inst89_result), .sel(SW[16]), .dataa(inst88_result), .result(inst92_result));
  BUSMUX #(.WIDTH(24)) inst93 (.datab(inst91_result), .sel(SW[16]), .dataa(inst90_result), .result(inst93_result));
  BUSMUX #(.WIDTH(24)) inst94 (.datab(inst93_result), .sel(SW[17]), .dataa(inst92_result), .result(seg_hex[23:0]));
  vga_controller #(.h_pulse(96), .h_bp(48), .h_pixels(640), .h_fp(16), .h_pol("'0'"), .v_pulse(2), .v_bp(33), .v_pixels(480), .v_fp(10), .v_pol("'0'")) inst26 (
    .pixel_clk(vga_clk), .reset_n(RESET_N), .h_sync(vga_hs), .v_sync(vga_vs), .disp_ena(vga_disp_ena),
    .column(VGA_CONTROLLER_X), .row(VGA_CONTROLLER_Y), .n_blank(vga_blank_n), .n_sync(vga_sync_n));
  BUSMUX #(.WIDTH(8)) inst100 (.datab(l3[23:16]), .sel(SW[13]), .dataa(l3[31:24]), .result(inst100_result));
  BUSMUX #(.WIDTH(8)) inst99 (.datab(l3[7:0]), .sel(SW[13]), .dataa(l3[15:8]), .result(inst99_result));
  assign seg_hex[24] = SW[15];  // WIRE inst85
  assign seg_hex[25] = SW[16];  // WIRE inst86
  assign seg_hex[26] = SW[17];  // WIRE inst87
  assign inst83_out = pxl_data_val;  // WIRE inst83
  assign inst84_out = vga_data_valid;  // WIRE inst84
  BUSMUX #(.WIDTH(8)) inst98 (.datab(inst99_result), .sel(SW[14]), .dataa(inst100_result), .result(inst98_result));
  BUSMUX #(.WIDTH(8)) inst102 (.datab(inst98_result), .sel(SW[12]), .dataa(inst39_data), .result(inst102_result));
  BUSMUX #(.WIDTH(1)) inst110 (.datab(inst83_out), .sel(SW[12]), .dataa(inst84_out), .result(inst110_result));
  BUSMUX #(.WIDTH(8)) inst96 (.datab(inst102_result), .sel(inst110_result), .dataa({8{1'b1}}), .result(vga_data_r));
  BUSMUX #(.WIDTH(8)) inst97 (.datab(inst102_result), .sel(inst110_result), .dataa({8{1'b0}}), .result(vga_data_g));
  BUSMUX #(.WIDTH(8)) inst101 (.datab(inst102_result), .sel(inst110_result), .dataa({8{1'b0}}), .result(vga_data_b));
  assign vga_r = {8{vga_disp_ena}} & vga_data_r;  // AND2 inst47, 8 bits wide
  assign vga_g = {8{vga_disp_ena}} & vga_data_g;  // AND2 inst48, 8 bits wide
  assign vga_b = {8{vga_disp_ena}} & vga_data_b;  // AND2 inst50, 8 bits wide

  assign CLRRXCC = 4'b0000;
  assign CLRRXCC_EN = 1'b1;
  assign CLRRXSERTC = UART_RXD;
  assign CLRRXSERTC_EN = 1'b1;
  assign CLRRXSERTFG_EN = 1'b0;
  assign UART_TXD = CLRRXSERTFG;

  // Other names for the same wires on the sheet: CLK50MHz = CLK50; DRAM_CLK_TEST = DRAM_CLK; vga_pixel_clk = vga_clk

  // Notes on the sheet:
  //   Generate 25.175Mhz clock
  //   MAC Data input
  //   Camera
  //   MAC Data Output
  //   VGA
  //   Image processing
endmodule
